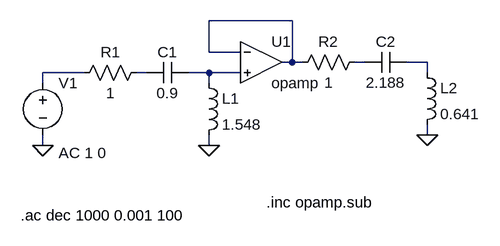
[diagram p0: schematic MP_Orden4.asc]
MP_Orden4.asc, the LTspice schematic file:
Version 4
SHEET 1 880 680
WIRE 336 32 208 32
WIRE 208 80 208 32
WIRE 256 80 208 80
WIRE 336 96 336 32
WIRE 336 96 320 96
WIRE 352 96 336 96
WIRE 448 96 432 96
WIRE 544 96 512 96
WIRE 16 112 -48 112
WIRE 112 112 96 112
WIRE 208 112 176 112
WIRE 256 112 208 112
WIRE 544 112 544 96
WIRE -48 128 -48 112
WIRE 208 128 208 112
WIRE 544 208 544 192
WIRE -48 224 -48 208
WIRE 208 224 208 208
FLAG 208 224 0
FLAG 544 208 0
FLAG -48 224 0
SYMBOL res 112 96 R90
WINDOW 0 0 56 VBottom 2
WINDOW 3 32 56 VTop 2
SYMATTR InstName R1
SYMATTR Value 1
SYMBOL cap 176 96 R90
WINDOW 0 0 32 VBottom 2
WINDOW 3 32 32 VTop 2
SYMATTR InstName C1
SYMATTR Value 0.9
SYMBOL ind 192 112 R0
SYMATTR InstName L1
SYMATTR Value 1.548
SYMBOL Opamps\\opamp 288 32 R0
SYMATTR InstName U1
SYMBOL res 448 80 R90
WINDOW 0 0 56 VBottom 2
WINDOW 3 32 56 VTop 2
SYMATTR InstName R2
SYMATTR Value 1
SYMBOL cap 512 80 R90
WINDOW 0 0 32 VBottom 2
WINDOW 3 32 32 VTop 2
SYMATTR InstName C2
SYMATTR Value 2.188
SYMBOL ind 528 96 R0
SYMATTR InstName L2
SYMATTR Value 0.641
SYMBOL voltage -48 112 R0
WINDOW 123 24 124 Left 2
WINDOW 39 0 0 Left 0
SYMATTR InstName V1
SYMATTR Value ""
SYMATTR Value2 AC 1 0
TEXT 296 312 Left 2 !.inc opamp.sub
TEXT -82 332 Left 2 !.ac dec 1000 0.001 100

The netlist it stands for:
* MP_Orden4.asc
R1 N005 N004 1
C1 N006 N005 0.9
L1 N006 0 1.548
XU1 N001 N006 N001 opamp Aol=100K GBW=10Meg  ; pins invin noninvin out
R2 N002 N001 1
C2 N003 N002 2.188
L2 N003 0 0.641
V1 N004 0 AC 1 0
.inc opamp.sub
.ac dec 1000 0.001 100
.backanno
.end